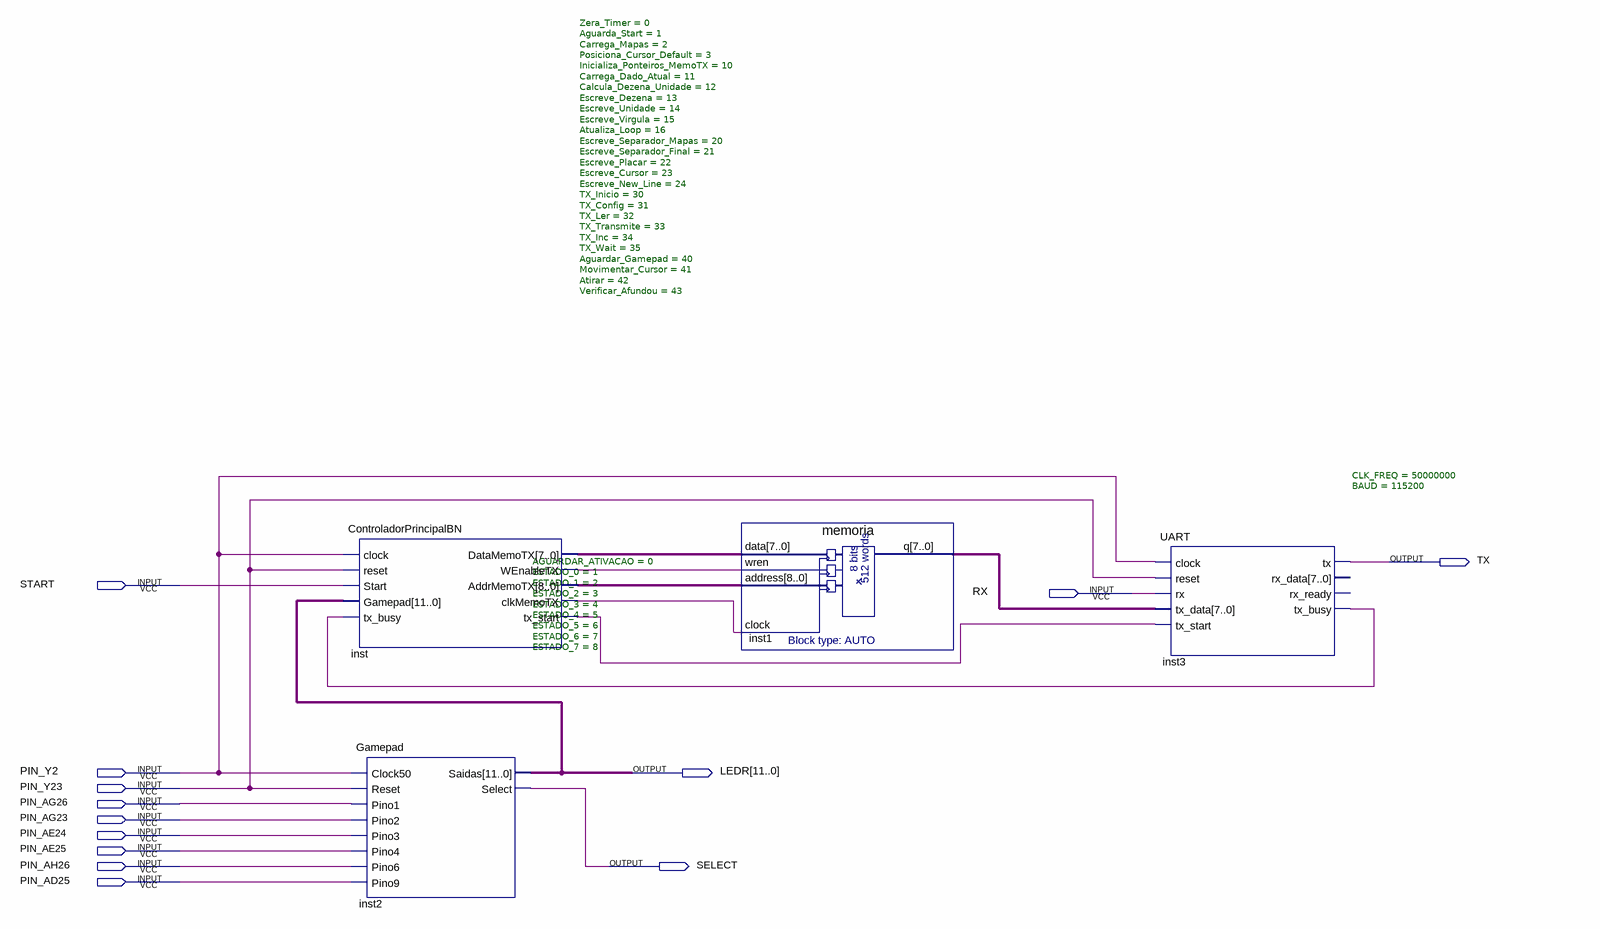
[diagram p0: schematic sheet]
// Quartus schematic batalhanaval.bdf as structural Verilog: 4 symbols, 13 pins
module batalhanaval (
  input  START,
  input  RX,
  input  PIN_Y2,
  input  PIN_Y23,
  input  PIN_AG26,
  input  PIN_AG23,
  input  PIN_AE24,
  input  PIN_AE25,
  input  PIN_AH26,
  input  PIN_AD25,
  output TX,
  output [11:0] LEDR,
  output SELECT
);

  wire inst3_tx_busy, inst_clkmemotx, inst_tx_start, inst_wenabletx;
  wire [7:0] inst1_q, inst_datamemotx;
  wire [8:0] inst_addrmemotx;

  ControladorPrincipalBN #(.Zera_Timer(0), .Aguarda_Start(1), .Carrega_Mapas(2), .Posiciona_Cursor_Default(3), .Inicializa_Ponteiros_MemoTX(10), .Carrega_Dado_Atual(11), .Calcula_Dezena_Unidade(12), .Escreve_Dezena(13), .Escreve_Unidade(14), .Escreve_Virgula(15), .Atualiza_Loop(16), .Escreve_Separador_Mapas(20), .Escreve_Separador_Final(21), .Escreve_Placar(22), .Escreve_Cursor(23), .Escreve_New_Line(24), .TX_Inicio(30), .TX_Config(31), .TX_Ler(32), .TX_Transmite(33), .TX_Inc(34), .TX_Wait(35), .Aguardar_Gamepad(40), .Movimentar_Cursor(41), .Atirar(42), .Verificar_Afundou(43)) inst (
    .clock(PIN_Y2), .reset(PIN_Y23), .Start(START), .Gamepad(LEDR), .tx_busy(inst3_tx_busy),
    .DataMemoTX(inst_datamemotx), .WEnableTX(inst_wenabletx), .AddrMemoTX(inst_addrmemotx),
    .clkMemoTX(inst_clkmemotx), .tx_start(inst_tx_start));
  Gamepad #(.AGUARDAR_ATIVACAO(0), .ESTADO_0(1), .ESTADO_1(2), .ESTADO_2(3), .ESTADO_3(4), .ESTADO_4(5), .ESTADO_5(6), .ESTADO_6(7), .ESTADO_7(8)) inst2 (
    .Clock50(PIN_Y2), .Reset(PIN_Y23), .Pino1(PIN_AG26), .Pino2(PIN_AG23), .Pino3(PIN_AE24),
    .Pino4(PIN_AE25), .Pino6(PIN_AH26), .Pino9(PIN_AD25), .Saidas(LEDR), .Select(SELECT));
  memoria inst1 (
    .data(inst_datamemotx), .wren(inst_wenabletx), .address(inst_addrmemotx), .clock(inst_clkmemotx),
    .q(inst1_q));
  UART #(.CLK_FREQ(50000000), .BAUD(115200)) inst3 (
    .clock(PIN_Y2), .reset(PIN_Y23), .rx(RX), .tx_data(inst1_q), .tx_start(inst_tx_start), .tx(TX),
    .tx_busy(inst3_tx_busy));  // open: rx_data, rx_ready
endmodule
